# EAGLE design foraging_board (EAGLE 7.5.0)
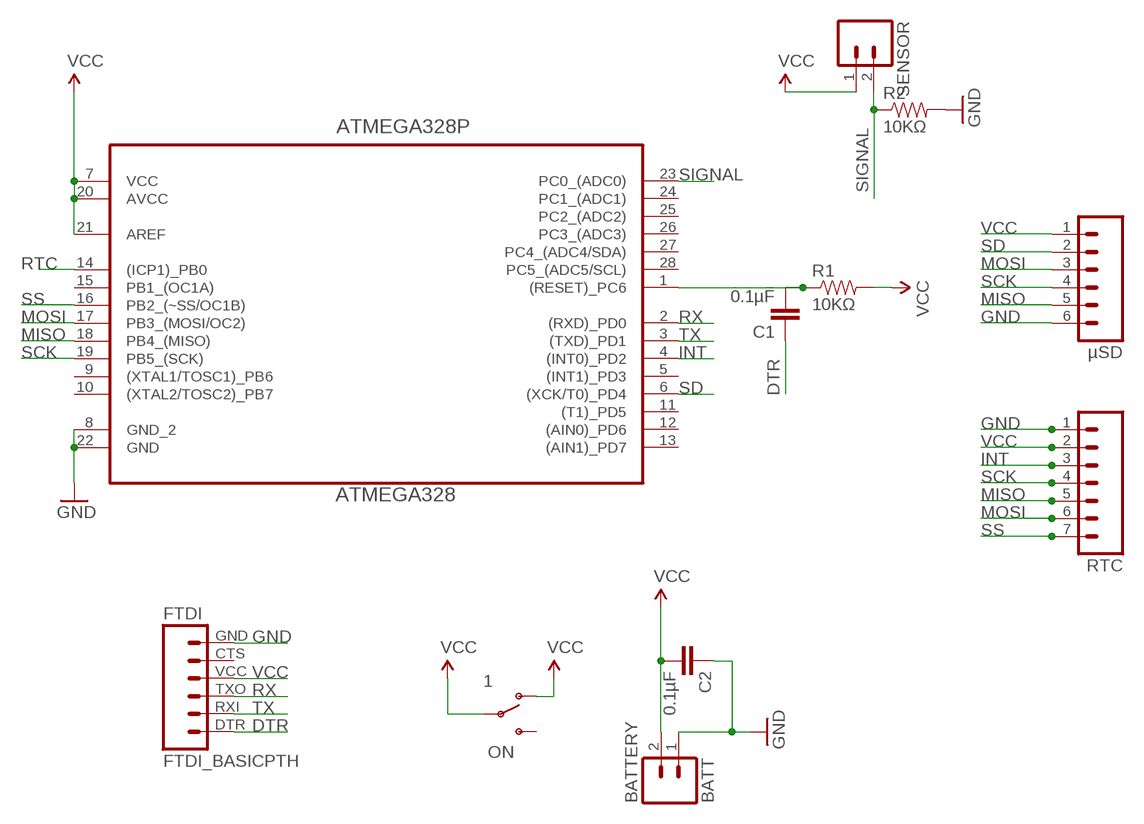
[diagram p0: schematic, sheet 1]

## Parts
ATMEGA328P  ATMEGA328  ATMEGA8L-8PU  [DIP254P762X457-28]
BATTERY  BATT  M02-JST-2-PTH-NO_SILK  [JST-2-PTH-NS]
C1  0.1µF  0.1UF-50V-20%(PTH)KIT-EZ  [CAP-PTH-SMALL-KIT]
C2  0.1µF  0.1UF-50V-20%(PTH)KIT-EZ  [CAP-PTH-SMALL-KIT]
FTDI  FTDI_BASICPTH  [FTDI_BASIC]
ON  1  SWITCH-SPSTKIT  [SWITCH-SPDT_KIT]
R1  10KΩ  RESISTOREZ  [AXIAL-0.3EZ]
R2  10KΩ  RESISTOREZ  [AXIAL-0.3EZ]
RTC  M07LONGPADS  [1X07_LONGPADS]
SENSOR  M02PTH  [1X02]
µSD  M06LONGPADS  [1X06_LONGPADS]

## Nets
DTR: C1.1 FTDI.DTR
GND: ATMEGA328P.8(GND_2) ATMEGA328P.22(GND) BATTERY.1 C2.1 FTDI.GND R2.P$2 RTC.1 µSD.6
INT: ATMEGA328P.4((INT0)_PD2) RTC.3
MISO: ATMEGA328P.18(PB4_(MISO)) RTC.5 µSD.5
MOSI: ATMEGA328P.17(PB3_(MOSI/OC2)) RTC.6 µSD.3
N$7: ATMEGA328P.1((RESET)_PC6) C1.2 R1.P$1
RTC: ATMEGA328P.14((ICP1)_PB0)
RX: ATMEGA328P.2((RXD)_PD0) FTDI.TXO
SCK: ATMEGA328P.19(PB5_(SCK)) RTC.4 µSD.4
SD: ATMEGA328P.6((XCK/T0)_PD4) µSD.2
SIGNAL: ATMEGA328P.23(PC0_(ADC0)) R2.P$1 SENSOR.2
SS: ATMEGA328P.16(PB2_(~SS/OC1B)) RTC.7
TX: ATMEGA328P.3((TXD)_PD1) FTDI.RXI
VCC: ATMEGA328P.7(VCC) ATMEGA328P.20(AVCC) ATMEGA328P.21(AREF) BATTERY.2 C2.2 FTDI.VCC ON.1(O) ON.2(P) R1.P$2 RTC.2 SENSOR.1 µSD.1
Unconnected: ATMEGA328P.5((INT1)_PD3) ATMEGA328P.9((XTAL1/TOSC1)_PB6) ATMEGA328P.10((XTAL2/TOSC2)_PB7) ATMEGA328P.11((T1)_PD5) ATMEGA328P.12((AIN0)_PD6) ATMEGA328P.13((AIN1)_PD7) ATMEGA328P.15(PB1_(OC1A)) ATMEGA328P.24(PC1_(ADC1)) ATMEGA328P.25(PC2_(ADC2)) ATMEGA328P.26(PC3_(ADC3)) ATMEGA328P.27(PC4_(ADC4/SDA)) ATMEGA328P.28(PC5_(ADC5/SCL)) FTDI.CTS ON.3(S)

## Library data of the parts
ATMEGA328P = Atmel_By_element14_Batch_1-00:ATMEGA8L-8PU: 8-bit with 8KBytes In-System Programmable Flash; DESCRIPTION: 8-bit with 8KBytes In-System Programmable Flash; MPN: ATMEGA8L-8PU; OC_FARNELL: 9171533; OC_NEWARK: 01M6903; PACKAGE: PCDIP-28; SUPPLIER: ATMEL
BATTERY SENSOR = SparkFun-Connectors:M02: Standard 2-pin 0.1" header. Use with - straight break away headers ( PRT-00116) - right angle break away headers (PRT-00553) - swiss pins (PRT-00743) - machine pins (PRT-00117) - female headers (PRT-00115) Molex polarized connector foot print use with: PRT-08233 with associated crimp pins and housings. 2.54_SCREWTERM for use with PRT-10571. 3.5mm Screw Terminal footprints for PRT-08084 5mm Screw Terminal footprints for use with PRT-08433
C1 C2 = SparkFun-Capacitors:0.1UF-50V-20%(PTH): CAP-08370; PROD_ID: CAP-08370
FTDI = SparkFun:FTDI_BASIC: FTDI Basic: 3.3V and 5V
ON = SparkFun:SWITCH-SPST: SPST Switch Simple slide switch. Spark Fun Electronics SKU : COM-00102
R1 R2 = SparkFun-Resistors:RESISTOR: Resistor Basic schematic elements and footprints for 0603, 1206, and PTH resistors.
RTC = SparkFun:M07: Header 7 Standard 7-pin 0.1" header. Use with straight break away headers (SKU : PRT-00116), right angle break away headers (PRT-00553), swiss pins (PRT-00743), machine pins (PRT-00117), and female headers (PRT-00115). NOTES ON THE VARIANTS LOCK and LOCK_LONGPADS... This footprint was designed to help hold the alignment of a through-hole component (i.e. 7-pin header) while soldering it into place. You may notice that each hole has been shifted either up or down by 0.005 of an inch from it's more standard position (which is usually a perfectly straight line). This slight alteration caused the pins (the squares in the middle) to touch the edges of the holes. Because they are alternating, it causes a "brace" to hold the header in place. 0.005 has proven to be the perfect amount of "off-center" position when using our standard breakaway headers. Although looks a little odd when you look at the bare footprint, once you have a header in there, the alteration is very hard to notice. Also, if you push a header all the way into place, it is covered up entirely on the bottom side. This idea of altering the position of holes to aid alignment will be further integrated into the Sparkfun Library for other footprints. It can help hold any component with 3 or more connection pins.
µSD = SparkFun:M06: Header 6 Standard 6-pin 0.1" header. Use with straight break away headers (SKU : PRT-00116), right angle break away headers (PRT-00553), swiss pins (PRT-00743), machine pins (PRT-00117), and female headers (PRT-00115). Molex polarized connector foot print use with SKU : PRT-08094 with associated crimp pins and housings. NOTES ON THE VARIANTS LOCK and LOCK_LONGPADS... This footprint was designed to help hold the alignment of a through-hole component (i.e. 6-pin header) while soldering it into place. You may notice that each hole has been shifted either up or down by 0.005 of an inch from it's more standard position (which is a perfectly straight line). This slight alteration caused the pins (the squares in the middle) to touch the edges of the holes. Because they are alternating, it causes a "brace" to hold the component in place. 0.005 has proven to be the perfect amount of "off-center" position when using our standard breakaway headers. Although looks a little odd when you look at the bare footprint, once you have a header in there, the alteration is very hard to notice. Also, if you push a header all the way into place, it is covered up entirely on the bottom side. This idea of altering the position of holes to aid alignment will be further integrated into the Sparkfun Library for other footprints. It can help hold any component with 3 or more connection pins.

## Board
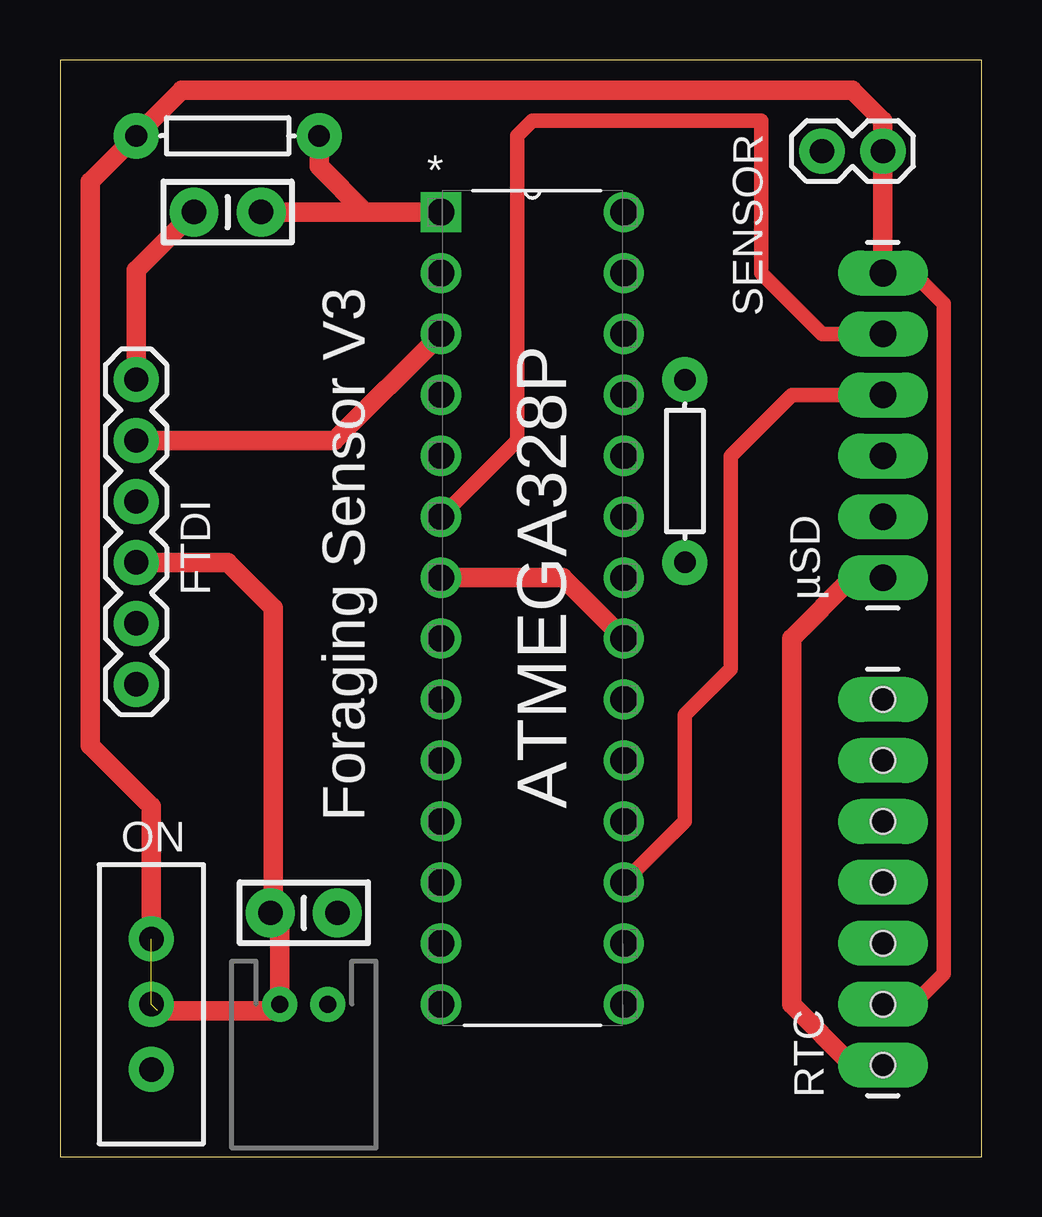
[diagram p1: board, top side]
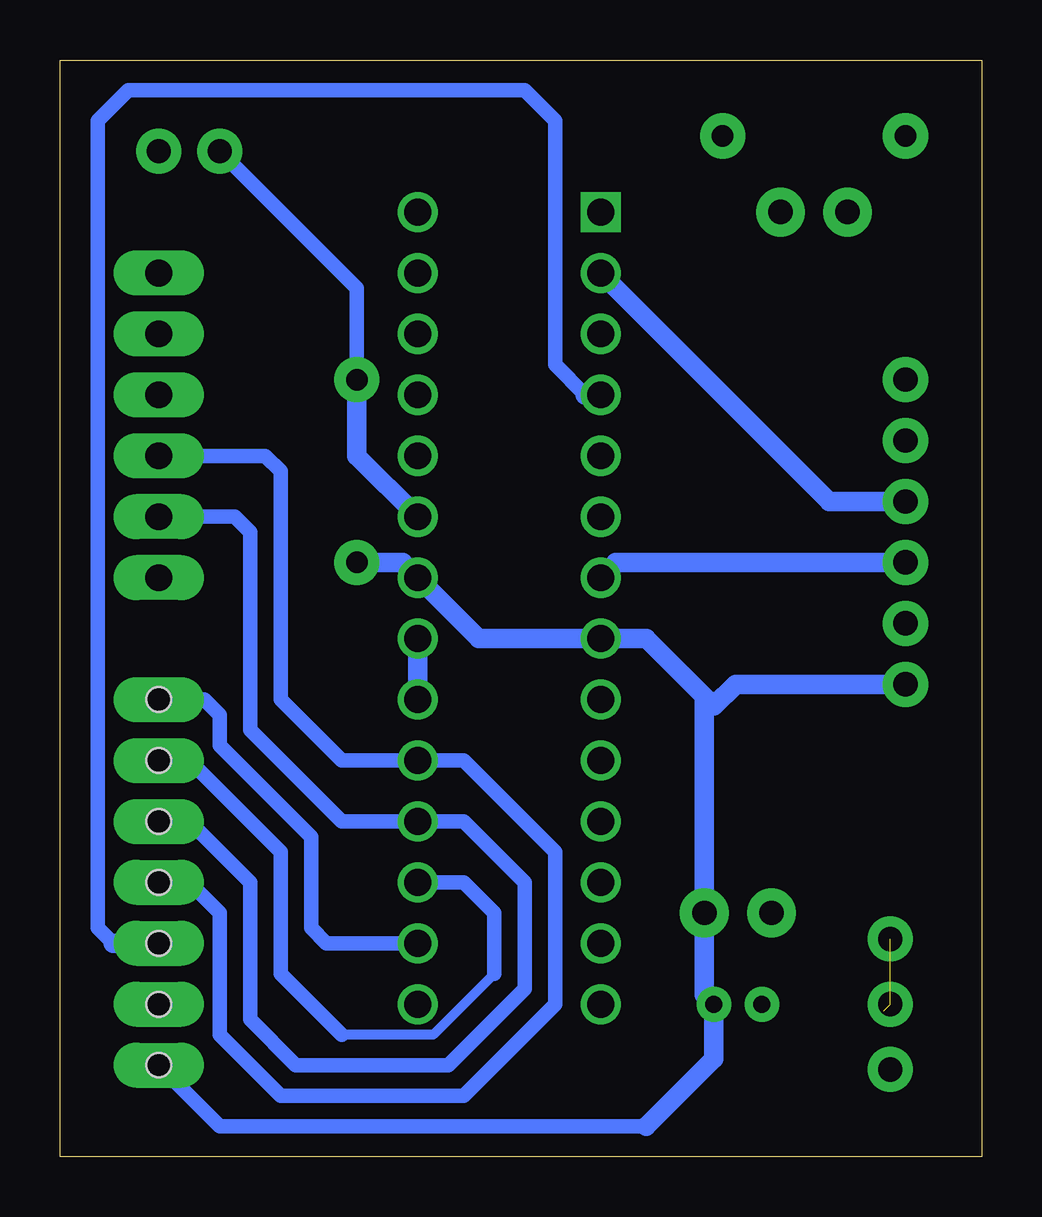
[diagram p2: board, bottom side, seen from below]

Size 38.41 x 45.71 mm. Coordinates in mm from the lower left corner, seen from the top.
Outline: 0,0 38.41,0 38.41,45.71 0,45.71 0,0
Copper layers (1*16): Top 0.035mm / dielectric 1.5mm / Bottom 0.035mm
Design rules "default": minimum track width 10mil, minimum drill 24mil, track to track 8mil, track to pad 8mil, pad to pad 8mil, via to via 8mil, smd to smd 8mil, copper to edge 40mil, drill to drill 8mil, minimum pad ring 10mil, minimum via ring 8mil, stop-mask expansion 4mil, vias tented up to drill 0mil, thermal gap 10mil

### Footprints (pad centres in the part's own frame; a part is rotated, then mirrored left to right if it is on the bottom)
DIP254P762X457-28 = drill 1.118 square: 1 -7.62,33.02 | drill 1.118: 2 -7.62,30.48; 3 -7.62,27.94; 4 -7.62,25.4; 5 -7.62,22.86; 6 -7.62,20.32; 7 -7.62,17.78; 8 -7.62,15.24; 9 -7.62,12.7; 10 -7.62,10.16; 11 -7.62,7.62; 12 -7.62,5.08; 13 -7.62,2.54; 14 -7.62,0; 15 0,0; 16 0,2.54; 17 0,5.08; 18 0,7.62; 19 0,10.16; 20 0,12.7; 21 0,15.24; 22 0,17.78; 23 0,20.32; 24 0,22.86; 25 0,25.4; 26 0,27.94; 27 0,30.48; 28 0,33.02
JST-2-PTH-NS = drill 0.7 pad 1.448: 1 -1,0; 2 1,0
CAP-PTH-SMALL-KIT = drill 1.016 pad 2.032: 1 -1.397,0; 2 1.397,0
FTDI_BASIC = drill 1.016 pad 1.88: CTS 10.16,0; DTR 0,0; GND 12.7,0; RXI 2.54,0; TXO 5.08,0; VCC 7.62,0
SWITCH-SPDT_KIT = drill 1.016 pad 1.88: 1 0,2.718; 2 0,0; 3 0,-2.718
AXIAL-0.3EZ = drill 0.9 pad 1.88: P$1 -3.81,0; P$2 3.81,0
1X07_LONGPADS = drill 1.016 pad 1.88 long: 1 0,0; 2 2.54,0; 3 5.08,0; 4 7.62,0; 5 10.16,0; 6 12.7,0; 7 15.24,0 | hole 1.016: 0,0; 2.54,0; 5.08,0; 7.62,0; 10.16,0; 12.7,0; 15.24,0
1X02 = drill 1.016 pad 1.88: 1 0,0; 2 2.54,0
1X06_LONGPADS = drill 1.118 pad 1.88 long: 1 0,0; 2 2.54,0; 3 5.08,0; 4 7.62,0; 5 10.16,0; 6 12.7,0

### Placement (x,y rotation side)
ATMEGA328P  23.5,6.35 0 top
BATTERY  10.16,6.35 180 top
C1  6.99,39.37 0 top
C2  10.16,10.16 180 top
FTDI  3.17,32.38 270 top
ON  3.81,6.35 0 top
R1  6.99,42.55 180 top
R2  26.04,28.57 270 top
RTC  34.29,3.81 90 top
SENSOR  34.29,41.91 180 top
µSD  34.29,36.83 270 top

### Tracks (layer width: path | path; a pad name or v marks a point on that pad's centre or on a via)
DTR
  Top 0.813: C1.1 3.17,36.96 FTDI.DTR
GND
  Top 0.61: 33.02,3.81 RTC.1
  Top 0.813: µSD.6 33.02,24.13 30.48,21.59 30.48,6.35 33.02,3.81
  Bottom 0.61: 13.97,1.27 31.75,1.27 RTC.1
  Bottom 0.813: R2.P$2 24.13,24.77 ATMEGA328P.22 20.95,21.59 ATMEGA328P.8 13.97,21.59 11.43,19.05 | 11.43,19.05 11.16,18.78 10.26,19.68 FTDI.GND | 13.97,1.27 11.16,4.08 BATTERY.1 11.56,6.75 C2.1 11.56,18.92 11.43,19.05
INT
  Bottom 0.61: 36.2,8.89 36.83,9.53 36.83,43.18 35.56,44.45 19.05,44.45 17.78,43.18 17.78,33.02 16.51,31.75
  Bottom 0.813: RTC.3 36.2,8.89 | 16.51,31.75 ATMEGA328P.4
MISO
  Bottom 0.61: µSD.5 31.11,26.67 30.48,26.04 30.48,17.78 26.67,13.97 ATMEGA328P.18 21.59,13.97 19.05,11.43 19.05,6.99 22.23,3.81 28.57,3.81 30.48,5.71 30.48,11.43 33.02,13.97 RTC.5
MOSI
  Top 0.61: µSD.3 30.48,31.75 27.94,29.21 27.94,20.32 26.04,18.41 26.04,13.97 ATMEGA328P.17
  Bottom 0.406: 20.32,7.62 22.86,5.08 26.67,5.08
  Bottom 0.61: 33.66,16.51 RTC.6 33.02,16.51 29.21,12.7 29.21,7.62 26.67,5.08 | 20.32,7.62 20.32,10.16 21.59,11.43 ATMEGA328P.17
N$7
  Top 0.813: 12.7,39.37 ATMEGA328P.1 | R1.P$1 10.79,41.27 12.7,39.37 | C1.2 12.7,39.37
RX
  Bottom 0.813: FTDI.TXO 6.35,27.3 ATMEGA328P.2
SCK
  Bottom 0.61: RTC.4 33.02,11.43 31.75,10.16 31.75,5.08 29.21,2.54 21.59,2.54 17.78,6.35 17.78,12.7 21.59,16.51 ATMEGA328P.19 26.67,16.51 29.21,19.05 29.21,28.57 29.84,29.21 µSD.4
SD
  Top 0.61: µSD.2 31.75,34.29 29.21,36.83 29.21,43.18 19.68,43.18 19.05,42.55 19.05,29.84 ATMEGA328P.6
SIGNAL
  Bottom 0.61: SENSOR.2 26.04,36.2 R2.P$1
  Bottom 0.813: R2.P$1 26.04,29.21 ATMEGA328P.23
SS
  Bottom 0.61: ATMEGA328P.16 27.3,8.89 27.94,9.53 27.94,12.7 27.94,13.34 31.75,17.14 31.75,18.41 32.38,19.05 RTC.7
TX
  Top 0.813: FTDI.RXI 11.43,29.84 ATMEGA328P.3
VCC  (2 unrouted)
  Top 0.61: µSD.1 35.56,36.83 36.83,35.56 36.83,7.62 35.56,6.35 | 8.89,6.08 BATTERY.2 | 8.89,10.29 C2.2
  Top 0.813: ATMEGA328P.7 20.95,24.13 ATMEGA328P.21 | RTC.2 35.56,6.35 | µSD.1 SENSOR.1 34.29,43.18 33.02,44.45 5.08,44.45 R1.P$2 1.27,40.64 1.27,17.14 3.81,14.61 ON.1 | 8.89,6.08 4.08,6.08 | C2.2 9.16,9.76 BATTERY.2 | FTDI.VCC 6.99,24.77 8.89,22.86 8.89,10.29
  Bottom 0.61: 35.56,6.35 RTC.2
  Bottom 0.813: ATMEGA328P.20 ATMEGA328P.21 | FTDI.VCC 15.24,24.77 ATMEGA328P.7

### Text on the board
tNames: Foraging Sensor V3